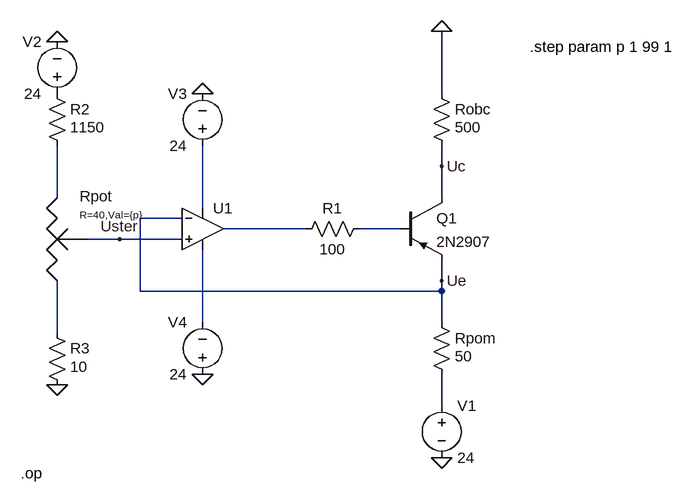
[diagram p0: schematic PNP_Rpom50.asc]
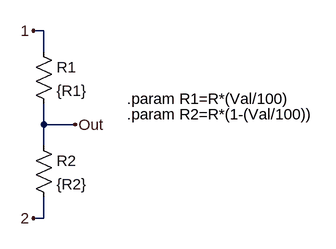
[diagram p1: sub-circuit potentiometer.asc]
PNP_Rpom50.asc, the LTspice schematic file:
Version 4
SHEET 1 880 680
WIRE 256 -32 256 -128
WIRE 256 80 256 48
WIRE -336 128 -336 48
WIRE 256 128 256 80
WIRE -112 144 -112 48
WIRE -144 160 -208 160
WIRE 48 176 -80 176
WIRE 192 176 128 176
WIRE -240 192 -288 192
WIRE -144 192 -240 192
WIRE 256 256 256 224
WIRE -208 272 -208 160
WIRE 256 272 256 256
WIRE 256 272 -208 272
WIRE -112 320 -112 208
WIRE 256 320 256 272
WIRE -336 336 -336 256
WIRE 256 448 256 400
FLAG 256 -128 0
FLAG 256 528 0
FLAG -336 416 0
FLAG -336 -112 0
FLAG -112 400 0
FLAG -112 -32 0
FLAG -240 192 Uster
FLAG 256 80 Uc
FLAG 256 256 Ue
SYMBOL res 240 304 R0
WINDOW 3 36 68 Left 2
SYMATTR InstName Rpom
SYMATTR Value 50
SYMBOL res 240 -48 R0
WINDOW 3 36 68 Left 2
SYMATTR InstName Robc
SYMATTR Value 500
SYMBOL res 144 160 R90
WINDOW 0 0 56 VBottom 2
WINDOW 3 32 56 VTop 2
SYMATTR InstName R1
SYMATTR Value 100
SYMBOL res -352 -48 R0
WINDOW 3 36 68 Left 2
SYMATTR InstName R2
SYMATTR Value 1150
SYMBOL res -352 320 R0
WINDOW 3 36 68 Left 2
SYMATTR InstName R3
SYMATTR Value 10
SYMBOL Potentiometer -336 192 R0
WINDOW 0 35 -66 Left 2
WINDOW 39 35 -38 Left 1
SYMATTR InstName Rpot
SYMATTR SpiceLine R=40,Val={p}
SYMBOL pnp 192 128 R0
SYMATTR InstName Q1
SYMATTR Value 2N2907
SYMBOL voltage 256 432 R0
WINDOW 123 0 0 Left 0
WINDOW 39 0 0 Left 0
SYMATTR InstName V1
SYMATTR Value 24
SYMBOL OpAmps\\UniversalOpamp2 -112 176 R0
SYMATTR InstName U1
SYMBOL voltage -336 -16 R180
WINDOW 0 24 96 Left 2
WINDOW 3 24 16 Left 2
WINDOW 123 0 0 Left 0
WINDOW 39 0 0 Left 0
SYMATTR InstName V2
SYMATTR Value 24
SYMBOL voltage -112 64 R180
WINDOW 0 24 96 Left 2
WINDOW 3 24 16 Left 2
WINDOW 123 0 0 Left 0
WINDOW 39 0 0 Left 0
SYMATTR InstName V3
SYMATTR Value 24
SYMBOL voltage -112 416 R180
WINDOW 0 24 96 Left 2
WINDOW 3 24 16 Left 2
WINDOW 123 0 0 Left 0
WINDOW 39 0 0 Left 0
SYMATTR InstName V4
SYMATTR Value 24
TEXT 392 -104 Left 2 !.step param p 1 99 1
TEXT -392 552 Left 2 !.op

potentiometer.asc, the sub-circuit schematic file:
Version 4
SHEET 1 880 680
WIRE 144 16 128 16
WIRE 144 48 144 16
WIRE 144 160 144 128
WIRE 192 160 144 160
WIRE 144 192 144 160
WIRE 144 304 144 272
WIRE 144 304 128 304
FLAG 128 16 1
FLAG 128 304 2
FLAG 192 160 Out
SYMBOL res 128 32 R0
SYMATTR InstName R1
SYMATTR Value {R1}
SYMBOL res 128 176 R0
SYMATTR InstName R2
SYMATTR Value {R2}
TEXT 272 120 Left 2 !.param R1=R*(Val/100)
TEXT 272 144 Left 2 !.param R2=R*(1-(Val/100))

The netlist it stands for:
* PNP_Rpom50.asc
Rpom Ue N007 50
Robc 0 Uc 500
R1 N004 N003 100
R2 P001 N001 1150
R3 N006 0 10
XRpot N001 N006 Uster potentiometer params: R=40,Val={p}
Q1 Uc N004 Ue 0 2N2907
V1 N007 0 24
XU1 Uster Ue N002 N005 N003 level.2 Avol=1Meg GBW=10Meg Slew=10Meg ilimit=25m rail=0 Vos=0 phimargin=45 en=0 enk=0 in=0 ink=0 Rin=500Meg  ; pins IN+ IN- V+ V- OUT
V2 P001 0 24
V3 N002 0 24
V4 0 N005 24

* block symbol definitions
.subckt potentiometer 1 2 Out
R1 1 Out {R1}
R2 Out 2 {R2}
.param R1=R*(Val/100)
.param R2=R*(1-(Val/100))
.ends potentiometer

.model NPN NPN
.model PNP PNP
.lib standard.bjt
.step param p 1 99 1
.op
.lib UniversalOpamps2.sub
.backanno
.end